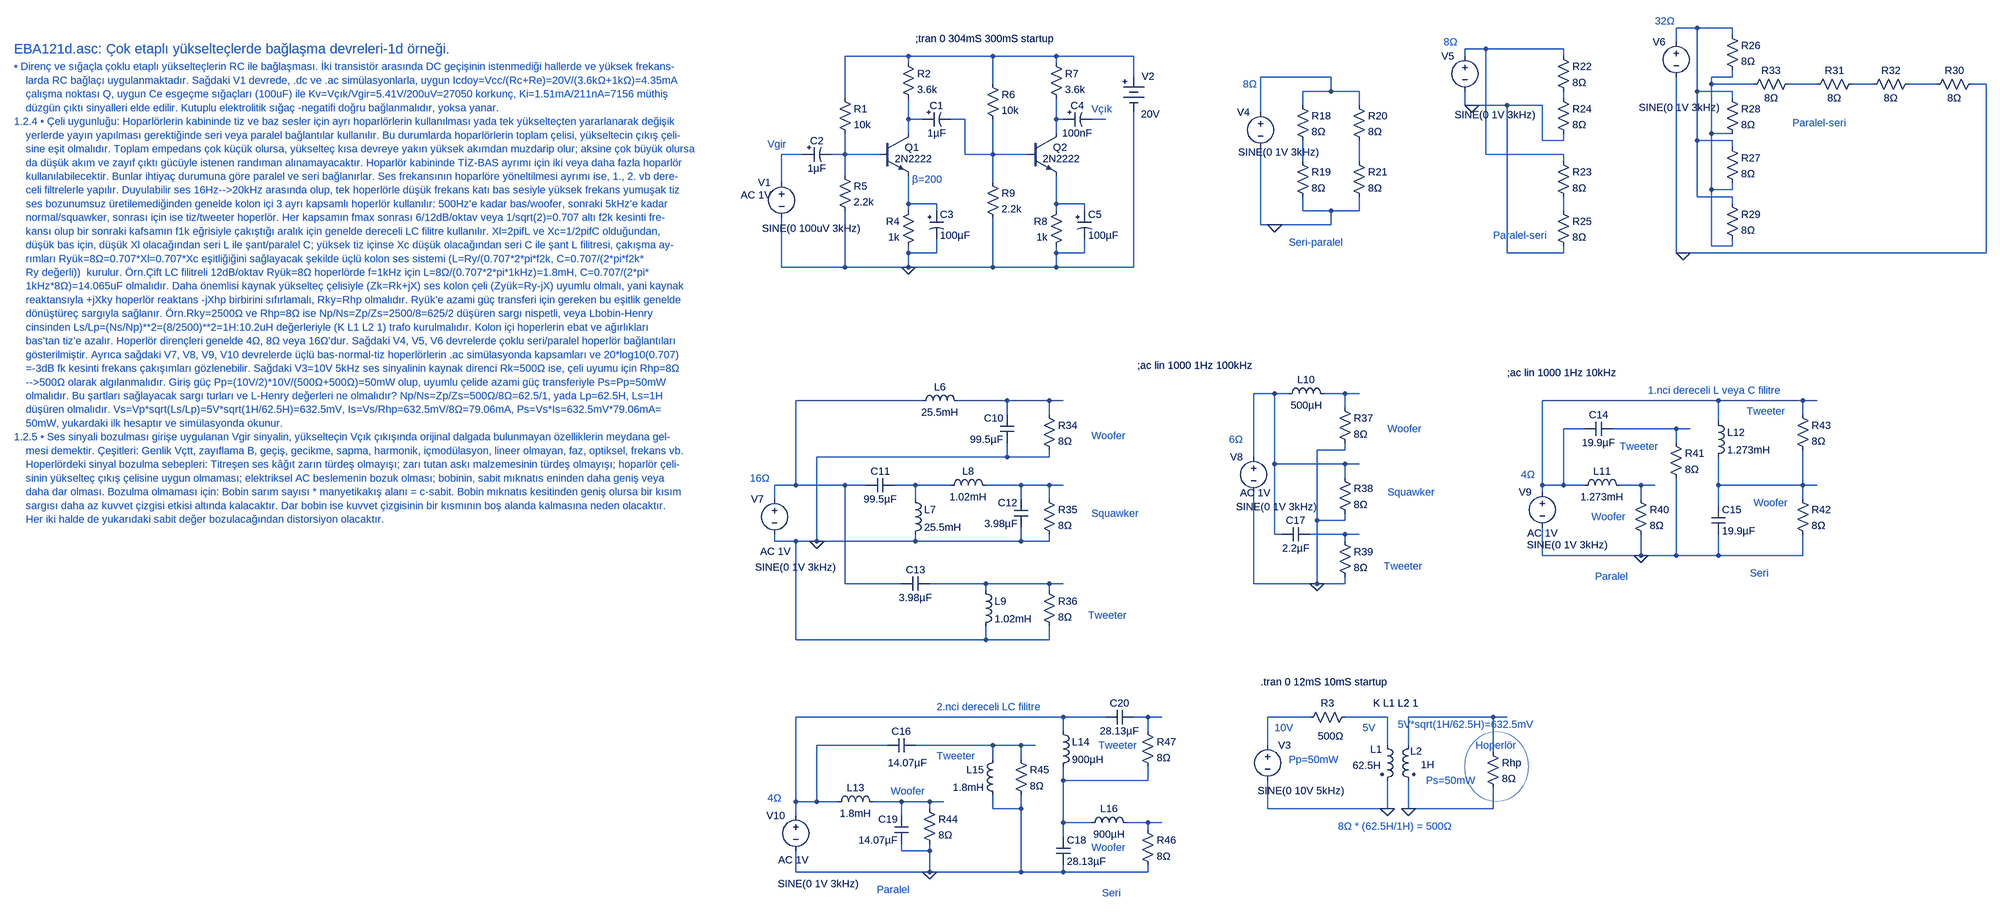
[diagram p0: schematic EBA121d.asc]
EBA121d.asc, the LTspice schematic file:
Version 4
SHEET 1 5332 4332
WIRE 3888 0 3840 0
WIRE 3968 0 3888 0
WIRE 3968 16 3968 0
WIRE 3840 32 3840 0
WIRE 3408 48 3360 48
WIRE 3584 48 3408 48
WIRE 2096 64 1952 64
WIRE 2288 64 2096 64
WIRE 2432 64 2288 64
WIRE 2608 64 2432 64
WIRE 3360 64 3360 48
WIRE 3584 64 3584 48
WIRE 2096 80 2096 64
WIRE 2432 80 2432 64
WIRE 2608 112 2608 64
WIRE 3056 112 2896 112
WIRE 3968 112 3968 96
WIRE 3968 112 3920 112
WIRE 2288 128 2288 64
WIRE 3920 128 3920 112
WIRE 4016 128 3920 128
WIRE 4160 128 4096 128
WIRE 4288 128 4240 128
WIRE 4432 128 4368 128
WIRE 4544 128 4512 128
WIRE 3056 144 3056 112
WIRE 3056 144 2992 144
WIRE 3120 144 3056 144
WIRE 3888 144 3888 0
WIRE 3968 144 3888 144
WIRE 1952 160 1952 64
WIRE 3584 160 3584 144
WIRE 3968 160 3968 144
WIRE 2992 176 2992 144
WIRE 3120 176 3120 144
WIRE 3360 176 3360 144
WIRE 3376 176 3360 176
WIRE 3456 176 3376 176
WIRE 3536 176 3456 176
WIRE 2896 192 2896 112
WIRE 2096 208 2096 160
WIRE 2128 208 2096 208
WIRE 2224 208 2192 208
WIRE 2432 208 2432 160
WIRE 2448 208 2432 208
WIRE 2544 208 2512 208
WIRE 2096 240 2096 208
WIRE 2432 240 2432 208
WIRE 3920 240 3920 128
WIRE 3968 240 3920 240
WIRE 3536 256 3536 176
WIRE 3584 256 3584 240
WIRE 3584 256 3536 256
WIRE 3888 256 3888 144
WIRE 3968 256 3888 256
WIRE 3968 272 3968 256
WIRE 1856 288 1808 288
WIRE 1952 288 1952 240
WIRE 1952 288 1920 288
WIRE 2032 288 1952 288
WIRE 2224 288 2224 208
WIRE 2288 288 2288 208
WIRE 2288 288 2224 288
WIRE 2368 288 2288 288
WIRE 3408 288 3408 48
WIRE 3584 288 3408 288
WIRE 2992 304 2992 256
WIRE 3120 304 3120 256
WIRE 3584 304 3584 288
WIRE 1952 336 1952 288
WIRE 1808 352 1808 288
WIRE 2288 352 2288 288
WIRE 3920 368 3920 240
WIRE 3968 368 3968 352
WIRE 3968 368 3920 368
WIRE 3888 384 3888 256
WIRE 3968 384 3888 384
WIRE 2096 400 2096 336
WIRE 2160 400 2096 400
WIRE 2432 400 2432 336
WIRE 2496 400 2432 400
WIRE 3968 400 3968 384
WIRE 2096 416 2096 400
WIRE 2160 416 2160 400
WIRE 2432 416 2432 400
WIRE 2496 416 2496 400
WIRE 2992 416 2992 384
WIRE 3056 416 2992 416
WIRE 3120 416 3120 384
WIRE 3120 416 3056 416
WIRE 3584 416 3584 384
WIRE 2896 448 2896 272
WIRE 2928 448 2896 448
WIRE 3056 448 3056 416
WIRE 3056 448 2928 448
WIRE 3920 496 3920 368
WIRE 3968 496 3968 480
WIRE 3968 496 3920 496
WIRE 2096 512 2096 496
WIRE 2160 512 2160 480
WIRE 2160 512 2096 512
WIRE 2432 512 2432 496
WIRE 2496 512 2496 480
WIRE 2496 512 2432 512
WIRE 3456 512 3456 176
WIRE 3584 512 3584 496
WIRE 3584 512 3456 512
WIRE 3840 512 3840 112
WIRE 3856 512 3840 512
WIRE 4544 512 4544 128
WIRE 4544 512 3856 512
WIRE 1808 544 1808 432
WIRE 1952 544 1952 416
WIRE 1952 544 1808 544
WIRE 2096 544 2096 512
WIRE 2096 544 1952 544
WIRE 2288 544 2288 432
WIRE 2288 544 2096 544
WIRE 2432 544 2432 512
WIRE 2432 544 2288 544
WIRE 2608 544 2608 192
WIRE 2608 544 2432 544
WIRE 2928 832 2880 832
WIRE 2960 832 2928 832
WIRE 3088 832 3040 832
WIRE 3120 832 3088 832
WIRE 2128 848 1840 848
WIRE 2320 848 2208 848
WIRE 2416 848 2320 848
WIRE 2448 848 2416 848
WIRE 3936 848 3536 848
WIRE 4128 848 3936 848
WIRE 4160 848 4128 848
WIRE 3088 864 3088 832
WIRE 2320 880 2320 848
WIRE 2416 880 2416 848
WIRE 4128 880 4128 848
WIRE 3936 896 3936 848
WIRE 3632 912 3584 912
WIRE 3840 912 3696 912
WIRE 3872 912 3840 912
WIRE 3840 944 3840 912
WIRE 3088 960 3088 944
WIRE 3088 960 3024 960
WIRE 2320 976 2320 944
WIRE 2320 976 1888 976
WIRE 2416 976 2416 960
WIRE 2416 976 2320 976
WIRE 2880 976 2880 832
WIRE 2928 992 2928 832
WIRE 3088 992 2928 992
WIRE 3120 992 3088 992
WIRE 3088 1024 3088 992
WIRE 1840 1040 1840 848
WIRE 1840 1040 1792 1040
WIRE 1952 1040 1840 1040
WIRE 2000 1040 1952 1040
WIRE 2112 1040 2064 1040
WIRE 2192 1040 2112 1040
WIRE 2352 1040 2272 1040
WIRE 2416 1040 2352 1040
WIRE 2448 1040 2416 1040
WIRE 3536 1040 3536 848
WIRE 3584 1040 3584 912
WIRE 3584 1040 3536 1040
WIRE 3632 1040 3584 1040
WIRE 3760 1040 3712 1040
WIRE 3792 1040 3760 1040
WIRE 3936 1040 3936 976
WIRE 4128 1040 4128 960
WIRE 4128 1040 3936 1040
WIRE 4160 1040 4128 1040
WIRE 3536 1056 3536 1040
WIRE 1792 1072 1792 1040
WIRE 2112 1072 2112 1040
WIRE 2352 1072 2352 1040
WIRE 2416 1072 2416 1040
WIRE 3760 1072 3760 1040
WIRE 4128 1072 4128 1040
WIRE 3936 1088 3936 1040
WIRE 3024 1120 3024 960
WIRE 3088 1120 3088 1104
WIRE 3088 1120 3024 1120
WIRE 2928 1152 2928 992
WIRE 2944 1152 2928 1152
WIRE 3088 1152 3008 1152
WIRE 3120 1152 3088 1152
WIRE 1792 1168 1792 1152
WIRE 1840 1168 1792 1168
WIRE 1888 1168 1888 976
WIRE 1888 1168 1840 1168
WIRE 2112 1168 2112 1152
WIRE 2112 1168 1888 1168
WIRE 2352 1168 2352 1136
WIRE 2352 1168 2112 1168
WIRE 2416 1168 2416 1152
WIRE 2416 1168 2352 1168
WIRE 3088 1168 3088 1152
WIRE 3536 1200 3536 1136
WIRE 3760 1200 3760 1152
WIRE 3760 1200 3536 1200
WIRE 3840 1200 3840 1024
WIRE 3840 1200 3760 1200
WIRE 3936 1200 3936 1152
WIRE 3936 1200 3840 1200
WIRE 4128 1200 4128 1152
WIRE 4128 1200 3936 1200
WIRE 1952 1264 1952 1040
WIRE 2080 1264 1952 1264
WIRE 2272 1264 2144 1264
WIRE 2416 1264 2272 1264
WIRE 2448 1264 2416 1264
WIRE 2880 1264 2880 1056
WIRE 3024 1264 3024 1120
WIRE 3024 1264 2880 1264
WIRE 3088 1264 3088 1248
WIRE 3088 1264 3024 1264
WIRE 2272 1280 2272 1264
WIRE 2416 1280 2416 1264
WIRE 1840 1392 1840 1168
WIRE 2272 1392 2272 1360
WIRE 2272 1392 1840 1392
WIRE 2416 1392 2416 1360
WIRE 2416 1392 2272 1392
WIRE 2448 1568 1840 1568
WIRE 2544 1568 2448 1568
WIRE 2640 1568 2608 1568
WIRE 2672 1568 2640 1568
WIRE 3008 1568 2912 1568
WIRE 3184 1568 3088 1568
WIRE 3424 1568 3232 1568
WIRE 3456 1568 3424 1568
WIRE 2448 1600 2448 1568
WIRE 2640 1600 2640 1568
WIRE 2048 1632 1888 1632
WIRE 2288 1632 2112 1632
WIRE 2352 1632 2288 1632
WIRE 2384 1632 2352 1632
WIRE 2912 1632 2912 1568
WIRE 3184 1632 3184 1568
WIRE 3232 1632 3232 1568
WIRE 3424 1648 3424 1568
WIRE 2288 1664 2288 1632
WIRE 2352 1664 2352 1632
WIRE 2448 1712 2448 1680
WIRE 2640 1712 2640 1680
WIRE 2640 1712 2448 1712
WIRE 1840 1760 1840 1568
WIRE 1888 1760 1888 1632
WIRE 1888 1760 1840 1760
WIRE 1936 1760 1888 1760
WIRE 2080 1760 2016 1760
WIRE 2144 1760 2080 1760
WIRE 2176 1760 2144 1760
WIRE 2144 1776 2144 1760
WIRE 2288 1776 2288 1744
WIRE 2352 1776 2352 1744
WIRE 2352 1776 2288 1776
WIRE 2912 1776 2912 1712
WIRE 3184 1776 3184 1712
WIRE 3184 1776 2912 1776
WIRE 3232 1776 3232 1712
WIRE 3424 1776 3424 1728
WIRE 3424 1776 3232 1776
WIRE 1840 1792 1840 1760
WIRE 2080 1792 2080 1760
WIRE 2448 1808 2448 1712
WIRE 2512 1808 2448 1808
WIRE 2640 1808 2592 1808
WIRE 2672 1808 2640 1808
WIRE 2640 1824 2640 1808
WIRE 2448 1840 2448 1808
WIRE 2080 1872 2080 1856
WIRE 2144 1872 2144 1856
WIRE 2144 1872 2080 1872
WIRE 1840 1920 1840 1872
WIRE 2144 1920 2144 1872
WIRE 2144 1920 1840 1920
WIRE 2352 1920 2352 1776
WIRE 2352 1920 2144 1920
WIRE 2448 1920 2448 1904
WIRE 2448 1920 2352 1920
WIRE 2640 1920 2640 1904
WIRE 2640 1920 2448 1920
FLAG 2096 544 0
FLAG 2928 448 0
FLAG 3376 176 0
FLAG 3856 512 0
FLAG 1888 1168 0
FLAG 3024 1264 0
FLAG 3760 1200 0
FLAG 2144 1920 0
FLAG 3232 1776 0
FLAG 3184 1776 0
SYMBOL npn 2032 240 R0
WINDOW 3 33 58 Left 2
SYMATTR Value 2N2222
SYMATTR InstName Q1
SYMBOL res 1936 144 R0
SYMATTR InstName R1
SYMATTR Value 10k
SYMBOL res 2080 64 R0
SYMATTR InstName R2
SYMATTR Value 3.6k
SYMBOL polcap 2128 192 M90
WINDOW 0 0 32 VBottom 2
WINDOW 3 32 32 VTop 2
SYMATTR InstName C1
SYMATTR Value 1µF
SYMBOL polcap 1856 272 M90
WINDOW 0 0 32 VBottom 2
WINDOW 3 32 32 VTop 2
SYMATTR InstName C2
SYMATTR Value 1µF
SYMBOL voltage 1808 336 M0
WINDOW 3 -179 120 Left 2
WINDOW 123 24 44 Left 2
WINDOW 39 0 0 Left 0
SYMATTR Value SINE(0 100uV 3kHz)
SYMATTR Value2 AC 1V
SYMATTR InstName V1
SYMBOL Misc\\battery 2608 96 R0
WINDOW 0 18 14 Left 2
WINDOW 3 16 100 Left 2
SYMATTR InstName V2
SYMATTR Value 20V
SYMBOL res 2112 400 M0
SYMATTR InstName R4
SYMATTR Value 1k
SYMBOL res 1936 320 R0
SYMATTR InstName R5
SYMATTR Value 2.2k
SYMBOL polcap 2144 416 R0
SYMATTR InstName C3
SYMATTR Value 100µF
SYMBOL npn 2368 240 R0
WINDOW 3 33 58 Left 2
SYMATTR Value 2N2222
SYMATTR InstName Q2
SYMBOL res 2272 112 R0
SYMATTR InstName R6
SYMATTR Value 10k
SYMBOL res 2416 64 R0
SYMATTR InstName R7
SYMATTR Value 3.6k
SYMBOL polcap 2448 192 M90
WINDOW 0 0 32 VBottom 2
WINDOW 3 32 32 VTop 2
SYMATTR InstName C4
SYMATTR Value 100nF
SYMBOL res 2448 400 M0
SYMATTR InstName R8
SYMATTR Value 1k
SYMBOL res 2272 336 R0
SYMATTR InstName R9
SYMATTR Value 2.2k
SYMBOL polcap 2480 416 R0
SYMATTR InstName C5
SYMATTR Value 100µF
SYMBOL res 2976 160 R0
SYMATTR InstName R18
SYMATTR Value 8Ω
SYMBOL res 2976 288 R0
SYMATTR InstName R19
SYMATTR Value 8Ω
SYMBOL res 3104 160 R0
SYMATTR InstName R20
SYMATTR Value 8Ω
SYMBOL res 3104 288 R0
SYMATTR InstName R21
SYMATTR Value 8Ω
SYMBOL voltage 2896 176 M0
WINDOW 3 -132 107 Left 2
WINDOW 123 47 42 Left 2
WINDOW 39 0 0 Left 0
SYMATTR Value SINE(0 1V 3kHz)
SYMATTR InstName V4
SYMBOL res 3568 48 R0
SYMATTR InstName R22
SYMATTR Value 8Ω
SYMBOL res 3568 288 R0
SYMATTR InstName R23
SYMATTR Value 8Ω
SYMBOL res 3568 144 R0
SYMATTR InstName R24
SYMATTR Value 8Ω
SYMBOL res 3568 400 R0
SYMATTR InstName R25
SYMATTR Value 8Ω
SYMBOL voltage 3360 48 M0
WINDOW 3 -160 150 Left 2
WINDOW 123 47 42 Left 2
WINDOW 39 0 0 Left 0
SYMATTR Value SINE(0 1V 3kHz)
SYMATTR InstName V5
SYMBOL res 3952 0 R0
SYMATTR InstName R26
SYMATTR Value 8Ω
SYMBOL res 3952 256 R0
SYMATTR InstName R27
SYMATTR Value 8Ω
SYMBOL res 3952 144 R0
SYMATTR InstName R28
SYMATTR Value 8Ω
SYMBOL res 3952 384 R0
SYMATTR InstName R29
SYMATTR Value 8Ω
SYMBOL voltage 3840 16 M0
WINDOW 3 -98 165 Left 2
WINDOW 123 47 42 Left 2
WINDOW 39 0 0 Left 0
SYMATTR Value SINE(0 1V 3kHz)
SYMATTR InstName V6
SYMBOL res 4528 112 R90
WINDOW 0 0 56 VBottom 2
WINDOW 3 32 56 VTop 2
SYMATTR InstName R30
SYMATTR Value 8Ω
SYMBOL res 4256 112 R90
WINDOW 0 0 56 VBottom 2
WINDOW 3 32 56 VTop 2
SYMATTR InstName R31
SYMATTR Value 8Ω
SYMBOL res 4384 112 R90
WINDOW 0 0 56 VBottom 2
WINDOW 3 32 56 VTop 2
SYMATTR InstName R32
SYMATTR Value 8Ω
SYMBOL res 4112 112 R90
WINDOW 0 0 56 VBottom 2
WINDOW 3 32 56 VTop 2
SYMATTR InstName R33
SYMATTR Value 8Ω
SYMBOL ind 2112 864 R270
WINDOW 0 32 56 VTop 2
WINDOW 3 5 56 VBottom 2
SYMATTR InstName L6
SYMATTR Value 25.5mH
SYMBOL cap 2336 880 M0
SYMATTR InstName C10
SYMATTR Value 99.5µF
SYMBOL res 2400 864 R0
SYMATTR InstName R34
SYMATTR Value 8Ω
SYMBOL cap 2064 1024 R90
WINDOW 0 0 32 VBottom 2
WINDOW 3 32 32 VTop 2
SYMATTR InstName C11
SYMATTR Value 99.5µF
SYMBOL ind 2096 1056 R0
SYMATTR InstName L7
SYMATTR Value 25.5mH
SYMBOL ind 2176 1056 R270
WINDOW 0 32 56 VTop 2
WINDOW 3 5 56 VBottom 2
SYMATTR InstName L8
SYMATTR Value 1.02mH
SYMBOL cap 2368 1072 M0
SYMATTR InstName C12
SYMATTR Value 3.98µF
SYMBOL res 2400 1056 R0
SYMATTR InstName R35
SYMATTR Value 8Ω
SYMBOL cap 2144 1248 R90
WINDOW 0 0 32 VBottom 2
WINDOW 3 32 32 VTop 2
SYMATTR InstName C13
SYMATTR Value 3.98µF
SYMBOL ind 2256 1264 R0
SYMATTR InstName L9
SYMATTR Value 1.02mH
SYMBOL res 2400 1264 R0
SYMATTR InstName R36
SYMATTR Value 8Ω
SYMBOL voltage 1792 1056 M0
WINDOW 3 -139 171 Left 2
WINDOW 123 -36 135 Left 2
WINDOW 39 0 0 Left 0
SYMATTR Value SINE(0 1V 3kHz)
SYMATTR Value2 AC 1V
SYMATTR InstName V7
SYMBOL ind 2944 848 R270
WINDOW 0 32 56 VTop 2
WINDOW 3 5 56 VBottom 2
SYMATTR InstName L10
SYMATTR Value 500µH
SYMBOL res 3072 848 R0
SYMATTR InstName R37
SYMATTR Value 8Ω
SYMBOL res 3072 1008 R0
SYMATTR InstName R38
SYMATTR Value 8Ω
SYMBOL cap 3008 1136 R90
WINDOW 0 0 32 VBottom 2
WINDOW 3 32 32 VTop 2
SYMATTR InstName C17
SYMATTR Value 2.2µF
SYMBOL res 3072 1152 R0
SYMATTR InstName R39
SYMATTR Value 8Ω
SYMBOL voltage 2880 960 M0
WINDOW 3 -143 129 Left 2
WINDOW 123 -38 98 Left 2
WINDOW 39 0 0 Left 0
SYMATTR Value SINE(0 1V 3kHz)
SYMATTR Value2 AC 1V
SYMATTR InstName V8
SYMBOL voltage 3536 1040 M0
WINDOW 3 -148 136 Left 2
WINDOW 123 -35 109 Left 2
WINDOW 39 0 0 Left 0
SYMATTR Value SINE(0 1V 3kHz)
SYMATTR Value2 AC 1V
SYMATTR InstName V9
SYMBOL ind 3616 1056 R270
WINDOW 0 32 56 VTop 2
WINDOW 3 5 56 VBottom 2
SYMATTR InstName L11
SYMATTR Value 1.273mH
SYMBOL res 3744 1056 R0
SYMATTR InstName R40
SYMATTR Value 8Ω
SYMBOL cap 3696 896 R90
WINDOW 0 0 32 VBottom 2
WINDOW 3 32 32 VTop 2
SYMATTR InstName C14
SYMATTR Value 19.9µF
SYMBOL res 3824 928 R0
SYMATTR InstName R41
SYMATTR Value 8Ω
SYMBOL ind 3920 880 R0
SYMATTR InstName L12
SYMATTR Value 1.273mH
SYMBOL cap 3920 1088 R0
SYMATTR InstName C15
SYMATTR Value 19.9µF
SYMBOL res 4112 1056 R0
SYMATTR InstName R42
SYMATTR Value 8Ω
SYMBOL res 4112 864 R0
SYMATTR InstName R43
SYMATTR Value 8Ω
SYMBOL voltage 1840 1776 M0
WINDOW 3 -142 171 Left 2
WINDOW 123 -29 117 Left 2
WINDOW 39 0 0 Left 0
SYMATTR Value SINE(0 1V 3kHz)
SYMATTR Value2 AC 1V
SYMATTR InstName V10
SYMBOL ind 1920 1776 R270
WINDOW 0 32 56 VTop 2
WINDOW 3 5 56 VBottom 2
SYMATTR InstName L13
SYMATTR Value 1.8mH
SYMBOL res 2128 1760 R0
SYMATTR InstName R44
SYMATTR Value 8Ω
SYMBOL cap 2112 1616 R90
WINDOW 0 0 32 VBottom 2
WINDOW 3 40 18 VTop 2
SYMATTR InstName C16
SYMATTR Value 14.07µF
SYMBOL res 2336 1648 R0
SYMATTR InstName R45
SYMATTR Value 8Ω
SYMBOL ind 2432 1584 R0
SYMATTR InstName L14
SYMATTR Value 900µH
SYMBOL cap 2432 1840 R0
SYMATTR InstName C18
SYMATTR Value 28.13µF
SYMBOL res 2624 1808 R0
SYMATTR InstName R46
SYMATTR Value 8Ω
SYMBOL res 2624 1584 R0
SYMATTR InstName R47
SYMATTR Value 8Ω
SYMBOL ind 2304 1648 M0
SYMATTR InstName L15
SYMATTR Value 1.8mH
SYMBOL cap 2096 1856 R180
WINDOW 0 24 56 Left 2
WINDOW 3 24 8 Left 2
SYMATTR InstName C19
SYMATTR Value 14.07µF
SYMBOL cap 2608 1552 R90
WINDOW 0 0 32 VBottom 2
WINDOW 3 32 32 VTop 2
SYMATTR InstName C20
SYMATTR Value 28.13µF
SYMBOL ind 2496 1824 R270
WINDOW 0 32 56 VTop 2
WINDOW 3 5 56 VBottom 2
SYMATTR InstName L16
SYMATTR Value 900µH
SYMBOL voltage 2912 1616 R0
WINDOW 3 -23 119 Left 2
WINDOW 123 0 0 Left 0
WINDOW 39 0 0 Left 0
SYMATTR Value SINE(0 10V 5kHz)
SYMATTR InstName V3
SYMBOL res 3104 1552 R90
WINDOW 0 0 56 VBottom 2
WINDOW 3 43 48 VTop 2
SYMATTR InstName R3
SYMATTR Value 500Ω
SYMBOL ind2 3168 1616 R0
WINDOW 3 -63 62 Left 2
WINDOW 0 -23 25 Left 2
SYMATTR Value 62.5H
SYMATTR InstName L1
SYMATTR Type ind
SYMBOL ind2 3248 1616 M0
WINDOW 0 -15 29 Left 2
WINDOW 3 -43 60 Left 2
SYMATTR InstName L2
SYMATTR Value 1H
SYMATTR Type ind
SYMBOL res 3408 1632 R0
SYMATTR InstName Rhp
SYMATTR Value 8Ω
TEXT -224 48 Left 3 ;EBA121d.asc: Çok etaplı yükselteçlerde bağlaşma devreleri-1d örneği.
TEXT -224 88 Left 2 ;• Direnç ve sığaçla çoklu etaplı yükselteçlerin RC ile bağlaşması. İki transistör arasında DC geçişinin istenmediği hallerde ve yüksek frekans-\n    larda RC bağlaçı uygulanmaktadır. Sağdaki V1 devrede, .dc ve .ac simülasyonlarla, uygun Icdoy=Vcc/(Rc+Re)=20V/(3.6kΩ+1kΩ)=4.35mA\n    çalışma noktası Q, uygun Ce esgeçme sığaçları (100uF) ile Kv=Vçık/Vgir=5.41V/200uV=27050 korkunç, Ki=1.51mA/211nA=7156 müthiş\n    düzgün çıktı sinyalleri elde edilir. Kutuplu elektrolitik sığaç -negatifi doğru bağlanmalıdır, yoksa yanar.\n1.2.4 • Çeli uygunluğu: Hoparlörlerin kabininde tiz ve baz sesler için ayrı hoparlörlerin kullanılması yada tek yükselteçten yararlanarak değişik \n    yerlerde yayın yapılması gerektiğinde seri veya paralel bağlantılar kullanılır. Bu durumlarda hoparlörlerin toplam çelisi, yükseltecin çıkış çeli-\n    sine eşit olmalıdır. Toplam empedans çok küçük olursa, yükselteç kısa devreye yakın yüksek akımdan muzdarip olur; aksine çok büyük olursa \n    da düşük akım ve zayıf çıktı gücüyle istenen randıman alınamayacaktır. Hoparlör kabininde TİZ-BAS ayrımı için iki veya daha fazla hoparlör\n    kullanılabilecektir. Bunlar ihtiyaç durumuna göre paralel ve seri bağlanırlar. Ses frekansının hoparlöre yöneltilmesi ayrımı ise, 1., 2. vb dere-\n    celi filtrelerle yapılır. Duyulabilir ses 16Hz-->20kHz arasında olup, tek hoperlörle düşük frekans katı bas sesiyle yüksek frekans yumuşak tiz\n    ses bozunumsuz üretilemediğinden genelde kolon içi 3 ayrı kapsamlı hoperlör kullanılır: 500Hz'e kadar bas/woofer, sonraki 5kHz'e kadar \n    normal/squawker, sonrası için ise tiz/tweeter hoperlör. Her kapsamın fmax sonrası 6/12dB/oktav veya 1/sqrt(2)=0.707 altı f2k kesinti fre-\n    kansı olup bir sonraki kafsamın f1k eğrisiyle çakıştığı aralık için genelde dereceli LC filitre kullanılır. Xl=2pifL ve Xc=1/2pifC olduğundan, \n    düşük bas için, düşük Xl olacağından seri L ile şant/paralel C; yüksek tiz içinse Xc düşük olacağından seri C ile şant L filitresi, çakışma ay-\n    rımları Ryük=8Ω=0.707*Xl=0.707*Xc eşitliğiğini sağlayacak şekilde üçlü kolon ses sistemi (L=Ry/(0.707*2*pi*f2k, C=0.707/(2*pi*f2k*\n    Ry değerli))  kurulur. Örn.Çift LC filitreli 12dB/oktav Ryük=8Ω hoperlörde f=1kHz için L=8Ω/(0.707*2*pi*1kHz)=1.8mH, C=0.707/(2*pi*\n    1kHz*8Ω)=14.065uF olmalıdır. Daha önemlisi kaynak yükselteç çelisiyle (Zk=Rk+jX) ses kolon çeli (Zyük=Ry-jX) uyumlu olmalı, yani kaynak\n    reaktansıyla +jXky hoperlör reaktans -jXhp birbirini sıfırlamalı, Rky=Rhp olmalıdır. Ryük'e azami güç transferi için gereken bu eşitlik genelde\n    dönüştüreç sargıyla sağlanır. Örn.Rky=2500Ω ve Rhp=8Ω ise Np/Ns=Zp/Zs=2500/8=625/2 düşüren sargı nispetli, veya Lbobin-Henry\n    cinsinden Ls/Lp=(Ns/Np)**2=(8/2500)**2=1H:10.2uH değerleriyle (K L1 L2 1) trafo kurulmalıdır. Kolon içi hoperlerin ebat ve ağırlıkları \n    bas'tan tiz'e azalır. Hoperlör dirençleri genelde 4Ω, 8Ω veya 16Ω'dur. Sağdaki V4, V5, V6 devrelerde çoklu seri/paralel hoperlör bağlantıları\n    gösterilmiştir. Ayrıca sağdaki V7, V8, V9, V10 devrelerde üçlü bas-normal-tiz hoperlörlerin .ac simülasyonda kapsamları ve 20*log10(0.707)\n    =-3dB fk kesinti frekans çakışımları gözlenebilir. Sağdaki V3=10V 5kHz ses sinyalinin kaynak direnci Rk=500Ω ise, çeli uyumu için Rhp=8Ω\n    -->500Ω olarak algılanmalıdır. Giriş güç Pp=(10V/2)*10V/(500Ω+500Ω)=50mW olup, uyumlu çelide azami güç transferiyle Ps=Pp=50mW\n    olmalıdır. Bu şartları sağlayacak sargı turları ve L-Henry değerleri ne olmalıdır? Np/Ns=Zp/Zs=500Ω/8Ω=62.5/1, yada Lp=62.5H, Ls=1H\n    düşüren olmalıdır. Vs=Vp*sqrt(Ls/Lp)=5V*sqrt(1H/62.5H)=632.5mV, Is=Vs/Rhp=632.5mV/8Ω=79.06mA, Ps=Vs*Is=632.5mV*79.06mA=\n    50mW, yukardaki ilk hesaptır ve simülasyonda okunur.\n1.2.5 • Ses sinyali bozulması girişe uygulanan Vgir sinyalin, yükselteçin Vçık çıkışında orijinal dalgada bulunmayan özelliklerin meydana gel-\n    mesi demektir. Çeşitleri: Genlik Vçtt, zayıflama B, geçiş, gecikme, sapma, harmonik, içmodülasyon, lineer olmayan, faz, optiksel, frekans vb.\n    Hoperlördeki sinyal bozulma sebepleri: Titreşen ses kâğıt zarın türdeş olmayışı; zarı tutan askı malzemesinin türdeş olmayışı; hoparlör çeli-\n    sinin yükselteç çıkış çelisine uygun olmaması; elektriksel AC beslemenin bozuk olması; bobinin, sabit mıknatıs eninden daha geniş veya \n    daha dar olması. Bozulma olmaması için: Bobin sarım sayısı * manyetikakış alanı = c-sabit. Bobin mıknatıs kesitinden geniş olursa bir kısım\n    sargısı daha az kuvvet çizgisi etkisi altında kalacaktır. Dar bobin ise kuvvet çizgisinin bir kısmının boş alanda kalmasına neden olacaktır. \n    Her iki halde de yukarıdaki sabit değer bozulacağından distorsiyon olacaktır.
TEXT 2512 184 Left 2 ;Vçık
TEXT 1776 264 Left 2 ;Vgir
TEXT 2112 24 Left 2 !;tran 0 304mS 300mS startup
TEXT 2104 344 Left 2 ;β=200
TEXT 2960 488 Left 2 ;Seri-paralel
TEXT 3424 472 Left 2 ;Paralel-seri
TEXT 4104 216 Left 2 ;Paralel-seri
TEXT 2504 1336 Left 2 ;Tweeter
TEXT 2512 928 Left 2 ;Woofer
TEXT 2512 1104 Left 2 ;Squawker
TEXT 3176 1224 Left 2 ;Tweeter
TEXT 3184 912 Left 2 ;Woofer
TEXT 3184 1056 Left 2 ;Squawker
TEXT 3712 952 Left 2 ;Tweeter
TEXT 3648 1112 Left 2 ;Woofer
TEXT 4000 872 Left 2 ;Tweeter
TEXT 4016 1080 Left 2 ;Woofer
TEXT 3656 1248 Left 2 ;Paralel
TEXT 4008 1240 Left 2 ;Seri
TEXT 3776 824 Left 2 ;1.nci dereceli L veya C filitre
TEXT 2160 1656 Left 2 ;Tweeter
TEXT 2056 1736 Left 2 ;Woofer
TEXT 2528 1632 Left 2 ;Tweeter
TEXT 2512 1864 Left 2 ;Woofer
TEXT 2024 1960 Left 2 ;Paralel
TEXT 2536 1968 Left 2 ;Seri
TEXT 2160 1544 Left 2 ;2.nci dereceli LC filitre
TEXT 3456 784 Left 2 !;ac lin 1000 1Hz 10kHz
TEXT 2616 768 Left 2 !;ac lin 1000 1Hz 100kHz
TEXT 2856 128 Left 2 ;8Ω
TEXT 3312 32 Left 2 ;8Ω
TEXT 3792 -16 Left 2 ;32Ω
TEXT 1736 1024 Left 2 ;16Ω
TEXT 2824 936 Left 2 ;6Ω
TEXT 3488 1016 Left 2 ;4Ω
TEXT 1776 1752 Left 2 ;4Ω
TEXT 3152 1536 Left 2 !K L1 L2 1
TEXT 2896 1488 Left 2 !.tran 0 12mS 10mS startup
TEXT 3384 1632 Left 2 ;Hoperlör
TEXT 3072 1816 Left 2 ;8Ω * (62.5H/1H) = 500Ω
TEXT 2928 1592 Left 2 ;10V
TEXT 3128 1592 Left 2 ;5V
TEXT 3208 1584 Left 2 ;5V*sqrt(1H/62.5H)=632.5mV
TEXT 2960 1664 Left 2 ;Pp=50mW
TEXT 3272 1712 Left 2 ;Ps=50mW
CIRCLE Normal 3504 1760 3360 1600 2

The netlist it stands for:
* EBA121d.asc
Q1 N010 N015 N018 0 2N2222
R1 N003 N015 10k
R2 N003 N010 3.6k
C1 N010 N011 1µF
C2 N014 N015 1µF
V1 N014 0 SINE(0 100uV 3kHz) AC 1V
V2 N003 0 20V
R4 N018 0 1k
R5 N015 0 2.2k
C3 N018 0 100µF
Q2 N012 N011 N019 0 2N2222
R6 N003 N011 10k
R7 N003 N012 3.6k
C4 N012 N013 100nF
R8 N019 0 1k
R9 N011 0 2.2k
C5 N019 0 100µF
R18 N004 N016 8Ω
R19 N016 0 8Ω
R20 N004 N017 8Ω
R21 N017 0 8Ω
V4 N004 0 SINE(0 1V 3kHz)
R22 N002 N009 8Ω
R23 N002 N020 8Ω
R24 N009 0 8Ω
R25 N020 0 8Ω
V5 N002 0 SINE(0 1V 3kHz)
R26 N001 N005 8Ω
R27 N001 N005 8Ω
R28 N001 N005 8Ω
R29 N001 N005 8Ω
V6 N001 0 SINE(0 1V 3kHz)
R30 0 N008 8Ω
R31 N007 N006 8Ω
R32 N008 N007 8Ω
R33 N006 N005 8Ω
L6 N023 N024 25.5mH
C10 N024 0 99.5µF
R34 N024 0 8Ω
C11 N027 N023 99.5µF
L7 N027 0 25.5mH
L8 N027 N028 1.02mH
C12 N028 0 3.98µF
R35 N028 0 8Ω
C13 N032 N023 3.98µF
L9 N032 0 1.02mH
R36 N032 0 8Ω
V7 N023 0 SINE(0 1V 3kHz) AC 1V
L10 N021 N022 500µH
R37 N022 0 8Ω
R38 N021 0 8Ω
C17 N031 N021 2.2µF
R39 N031 0 8Ω
V8 N021 0 SINE(0 1V 3kHz) AC 1V
V9 N025 0 SINE(0 1V 3kHz) AC 1V
L11 N025 N029 1.273mH
R40 N029 0 8Ω
C14 N026 N025 19.9µF
R41 N026 0 8Ω
L12 N025 N030 1.273mH
C15 N030 0 19.9µF
R42 N030 0 8Ω
R43 N025 N030 8Ω
V10 N033 0 SINE(0 1V 3kHz) AC 1V
L13 N033 N040 1.8mH
R44 N040 0 8Ω
C16 N038 N033 14.07µF
R45 N038 0 8Ω
L14 N033 N039 900µH
C18 N039 0 28.13µF
R46 N041 0 8Ω
R47 N034 N039 8Ω
L15 N038 0 1.8mH
C19 0 N040 14.07µF
C20 N034 N033 28.13µF
L16 N039 N041 900µH
V3 N035 0 SINE(0 10V 5kHz)
R3 N036 N035 500Ω
L1 N036 0 62.5H
L2 N037 0 1H
Rhp N037 0 8Ω
.model NPN NPN
.model PNP PNP
.lib standard.bjt
* EBA121d.asc: Çok etaplı yükselteçlerde bağlaşma devreleri-1d örneği.
* • Direnç ve sığaçla çoklu etaplı yükselteçlerin RC ile bağlaşması. İki transistör arasında DC geçişinin istenmediği hallerde ve yüksek frekans-
*     larda RC bağlaçı uygulanmaktadır. Sağdaki V1 devrede, .dc ve .ac simülasyonlarla, uygun Icdoy=Vcc/(Rc+Re)=20V/(3.6kΩ+1kΩ)=4.35mA
*     çalışma noktası Q, uygun Ce esgeçme sığaçları (100uF) ile Kv=Vçık/Vgir=5.41V/200uV=27050 korkunç, Ki=1.51mA/211nA=7156 müthiş
*     düzgün çıktı sinyalleri elde edilir. Kutuplu elektrolitik sığaç -negatifi doğru bağlanmalıdır, yoksa yanar.
* 1.2.4 • Çeli uygunluğu: Hoparlörlerin kabininde tiz ve baz sesler için ayrı hoparlörlerin kullanılması yada tek yükselteçten yararlanarak değişik
*     yerlerde yayın yapılması gerektiğinde seri veya paralel bağlantılar kullanılır. Bu durumlarda hoparlörlerin toplam çelisi, yükseltecin çıkış çeli-
*     sine eşit olmalıdır. Toplam empedans çok küçük olursa, yükselteç kısa devreye yakın yüksek akımdan muzdarip olur; aksine çok büyük olursa
*     da düşük akım ve zayıf çıktı gücüyle istenen randıman alınamayacaktır. Hoparlör kabininde TİZ-BAS ayrımı için iki veya daha fazla hoparlör
*     kullanılabilecektir. Bunlar ihtiyaç durumuna göre paralel ve seri bağlanırlar. Ses frekansının hoparlöre yöneltilmesi ayrımı ise, 1., 2. vb dere-
*     celi filtrelerle yapılır. Duyulabilir ses 16Hz-->20kHz arasında olup, tek hoperlörle düşük frekans katı bas sesiyle yüksek frekans yumuşak tiz
*     ses bozunumsuz üretilemediğinden genelde kolon içi 3 ayrı kapsamlı hoperlör kullanılır: 500Hz'e kadar bas/woofer, sonraki 5kHz'e kadar
*     normal/squawker, sonrası için ise tiz/tweeter hoperlör. Her kapsamın fmax sonrası 6/12dB/oktav veya 1/sqrt(2)=0.707 altı f2k kesinti fre-
*     kansı olup bir sonraki kafsamın f1k eğrisiyle çakıştığı aralık için genelde dereceli LC filitre kullanılır. Xl=2pifL ve Xc=1/2pifC olduğundan,
*     düşük bas için, düşük Xl olacağından seri L ile şant/paralel C; yüksek tiz içinse Xc düşük olacağından seri C ile şant L filitresi, çakışma ay-
*     rımları Ryük=8Ω=0.707*Xl=0.707*Xc eşitliğiğini sağlayacak şekilde üçlü kolon ses sistemi (L=Ry/(0.707*2*pi*f2k, C=0.707/(2*pi*f2k*
*     Ry değerli))  kurulur. Örn.Çift LC filitreli 12dB/oktav Ryük=8Ω hoperlörde f=1kHz için L=8Ω/(0.707*2*pi*1kHz)=1.8mH, C=0.707/(2*pi*
*     1kHz*8Ω)=14.065uF olmalıdır. Daha önemlisi kaynak yükselteç çelisiyle (Zk=Rk+jX) ses kolon çeli (Zyük=Ry-jX) uyumlu olmalı, yani kaynak
*     reaktansıyla +jXky hoperlör reaktans -jXhp birbirini sıfırlamalı, Rky=Rhp olmalıdır. Ryük'e azami güç transferi için gereken bu eşitlik genelde
*     dönüştüreç sargıyla sağlanır. Örn.Rky=2500Ω ve Rhp=8Ω ise Np/Ns=Zp/Zs=2500/8=625/2 düşüren sargı nispetli, veya Lbobin-Henry
*     cinsinden Ls/Lp=(Ns/Np)**2=(8/2500)**2=1H:10.2uH değerleriyle (K L1 L2 1) trafo kurulmalıdır. Kolon içi hoperlerin ebat ve ağırlıkları
*     bas'tan tiz'e azalır. Hoperlör dirençleri genelde 4Ω, 8Ω veya 16Ω'dur. Sağdaki V4, V5, V6 devrelerde çoklu seri/paralel hoperlör bağlantıları
*     gösterilmiştir. Ayrıca sağdaki V7, V8, V9, V10 devrelerde üçlü bas-normal-tiz hoperlörlerin .ac simülasyonda kapsamları ve 20*log10(0.707)
*     =-3dB fk kesinti frekans çakışımları gözlenebilir. Sağdaki V3=10V 5kHz ses sinyalinin kaynak direnci Rk=500Ω ise, çeli uyumu için Rhp=8Ω
*     -->500Ω olarak algılanmalıdır. Giriş güç Pp=(10V/2)*10V/(500Ω+500Ω)=50mW olup, uyumlu çelide azami güç transferiyle Ps=Pp=50mW
*     olmalıdır. Bu şartları sağlayacak sargı turları ve L-Henry değerleri ne olmalıdır? Np/Ns=Zp/Zs=500Ω/8Ω=62.5/1, yada Lp=62.5H, Ls=1H
*     düşüren olmalıdır. Vs=Vp*sqrt(Ls/Lp)=5V*sqrt(1H/62.5H)=632.5mV, Is=Vs/Rhp=632.5mV/8Ω=79.06mA, Ps=Vs*Is=632.5mV*79.06mA=
*     50mW, yukardaki ilk hesaptır ve simülasyonda okunur.
* 1.2.5 • Ses sinyali bozulması girişe uygulanan Vgir sinyalin, yükselteçin Vçık çıkışında orijinal dalgada bulunmayan özelliklerin meydana gel-
*     mesi demektir. Çeşitleri: Genlik Vçtt, zayıflama B, geçiş, gecikme, sapma, harmonik, içmodülasyon, lineer olmayan, faz, optiksel, frekans vb.
*     Hoperlördeki sinyal bozulma sebepleri: Titreşen ses kâğıt zarın türdeş olmayışı; zarı tutan askı malzemesinin türdeş olmayışı; hoparlör çeli-
*     sinin yükselteç çıkış çelisine uygun olmaması; elektriksel AC beslemenin bozuk olması; bobinin, sabit mıknatıs eninden daha geniş veya
*     daha dar olması. Bozulma olmaması için: Bobin sarım sayısı * manyetikakış alanı = c-sabit. Bobin mıknatıs kesitinden geniş olursa bir kısım
*     sargısı daha az kuvvet çizgisi etkisi altında kalacaktır. Dar bobin ise kuvvet çizgisinin bir kısmının boş alanda kalmasına neden olacaktır.
*     Her iki halde de yukarıdaki sabit değer bozulacağından distorsiyon olacaktır.
* Vçık
* Vgir
;tran 0 304mS 300mS startup
* β=200
* Seri-paralel
* Paralel-seri
* Paralel-seri
* Tweeter
* Woofer
* Squawker
* Tweeter
* Woofer
* Squawker
* Tweeter
* Woofer
* Tweeter
* Woofer
* Paralel
* Seri
* 1.nci dereceli L veya C filitre
* Tweeter
* Woofer
* Tweeter
* Woofer
* Paralel
* Seri
* 2.nci dereceli LC filitre
;ac lin 1000 1Hz 10kHz
;ac lin 1000 1Hz 100kHz
* 8Ω
* 8Ω
* 32Ω
* 16Ω
* 6Ω
* 4Ω
* 4Ω
K L1 L2 1
.tran 0 12mS 10mS startup
* Hoperlör
* 8Ω * (62.5H/1H) = 500Ω
* 10V
* 5V
* 5V*sqrt(1H/62.5H)=632.5mV
* Pp=50mW
* Ps=50mW
.backanno
.end